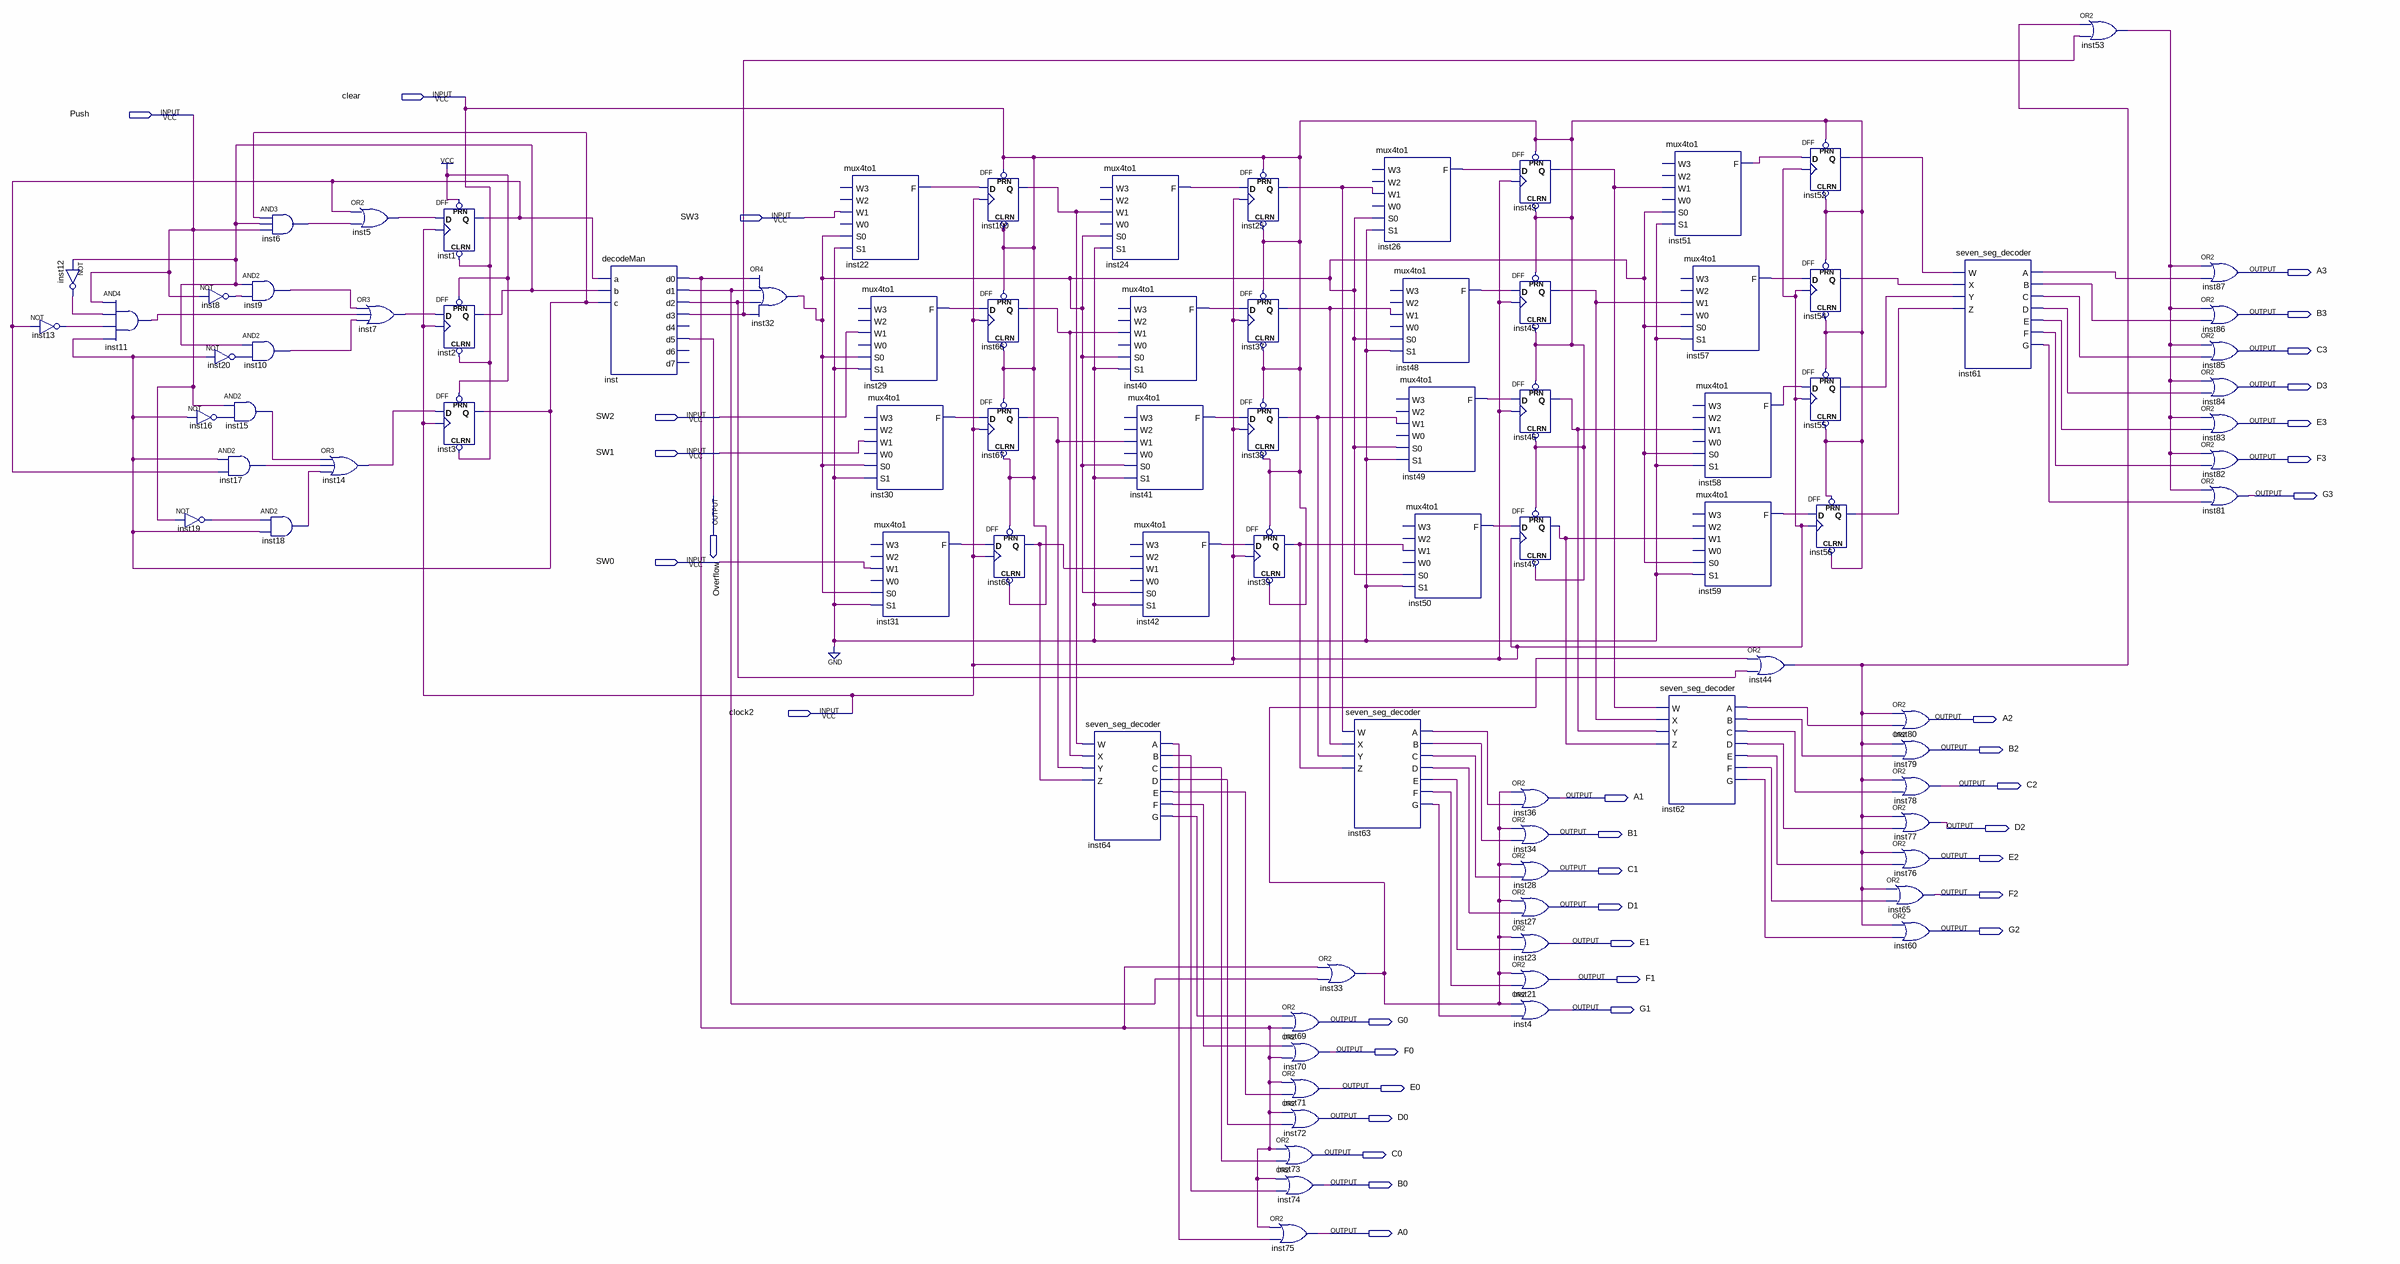
[diagram p0: schematic sheet]
// Quartus schematic Push.bdf as structural Verilog: 88 symbols, 36 pins
module Push (
  input  clear,
  input  Push,
  input  SW3,
  input  SW2,
  input  SW1,
  input  SW0,
  input  clock2,
  output A3,
  output B3,
  output C3,
  output D3,
  output E3,
  output F3,
  output Overflow,
  output G3,
  output A2,
  output B2,
  output C2,
  output A1,
  output D2,
  output B1,
  output E2,
  output C1,
  output F2,
  output D1,
  output G2,
  output E1,
  output F1,
  output G1,
  output G0,
  output F0,
  output E0,
  output D0,
  output C0,
  output B0,
  output A0
);

  wire inst1_q, inst2_q, inst3_q, inst5_out, inst6_out, inst7_out, inst8_out, inst9_out, inst10_out,
       inst11_out, inst12_out, inst13_out, inst14_out, inst15_out, inst16_out, inst17_out, inst18_out,
       inst19_out, inst20_out, inst22_f, inst24_f, inst25_q, inst26_f, inst29_f, inst30_f, inst31_f,
       inst32_out, inst33_out, inst37_q, inst38_q, inst39_q, inst40_f, inst41_f, inst42_f, inst43_q,
       inst44_out, inst45_q, inst46_q, inst47_q, inst48_f, inst49_f, inst50_f, inst51_f, inst52_q,
       inst53_out, inst54_q, inst55_q, inst56_q, inst57_f, inst58_f, inst59_f, inst61_a, inst61_b, inst61_c,
       inst61_d, inst61_e, inst61_f, inst61_g, inst62_a, inst62_b, inst62_c, inst62_d, inst62_e, inst62_f,
       inst62_g, inst63_a, inst63_b, inst63_c, inst63_d, inst63_e, inst63_f, inst63_g, inst64_a, inst64_b,
       inst64_c, inst64_d, inst64_e, inst64_f, inst64_g, inst66_q, inst67_q, inst68_q, inst100_q, inst_d0,
       inst_d1, inst_d2, inst_d3;

  not inst13 (inst13_out, inst1_q);
  not inst12 (inst12_out, inst2_q);
  and inst11 (inst11_out, Push, inst12_out, inst13_out, inst3_q);
  not inst19 (inst19_out, Push);
  not inst8 (inst8_out, Push);
  not inst20 (inst20_out, inst3_q);
  and inst15 (inst15_out, Push, inst16_out);
  not inst16 (inst16_out, inst3_q);
  and inst17 (inst17_out, inst3_q, inst1_q);
  and inst6 (inst6_out, inst3_q, inst2_q, Push);
  and inst9 (inst9_out, inst2_q, inst8_out);
  and inst10 (inst10_out, inst2_q, inst20_out);
  and inst18 (inst18_out, inst19_out, inst3_q);
  or inst14 (inst14_out, inst15_out, inst17_out, inst18_out);
  or inst5 (inst5_out, inst1_q, inst6_out);
  or inst7 (inst7_out, inst9_out, inst11_out, inst10_out);
  DFF inst1 (.CLRN(clear), .CLK(clock2), .D(inst5_out), .PRN(1'b1), .Q(inst1_q));
  DFF inst2 (.CLRN(clear), .CLK(clock2), .D(inst7_out), .PRN(1'b1), .Q(inst2_q));
  DFF inst3 (.CLRN(clear), .CLK(clock2), .D(inst14_out), .PRN(1'b1), .Q(inst3_q));
  decodeMan inst (
    .a(inst1_q), .b(inst2_q), .c(inst3_q), .d0(inst_d0), .d1(inst_d1), .d2(inst_d2), .d3(inst_d3),
    .d5(Overflow));  // open: d4, d6, d7
  or inst32 (inst32_out, inst_d0, inst_d1, inst_d2, inst_d3);
  mux4to1 inst22 (.W1(SW3), .S0(inst32_out), .S1(1'b0), .F(inst22_f));  // open: W3, W2, W0
  mux4to1 inst29 (.W1(SW2), .S0(inst32_out), .S1(1'b0), .F(inst29_f));  // open: W3, W2, W0
  mux4to1 inst30 (.W1(SW1), .S0(inst32_out), .S1(1'b0), .F(inst30_f));  // open: W3, W2, W0
  mux4to1 inst31 (.W1(SW0), .S0(inst32_out), .S1(1'b0), .F(inst31_f));  // open: W3, W2, W0
  DFF inst100 (.CLRN(clear), .CLK(clock2), .D(inst22_f), .PRN(clear), .Q(inst100_q));
  DFF inst66 (.CLRN(clear), .CLK(clock2), .D(inst29_f), .PRN(clear), .Q(inst66_q));
  DFF inst67 (.CLRN(clear), .CLK(clock2), .D(inst30_f), .PRN(clear), .Q(inst67_q));
  DFF inst68 (.CLRN(clear), .CLK(clock2), .D(inst31_f), .PRN(clear), .Q(inst68_q));
  mux4to1 inst24 (.W1(inst100_q), .S0(inst32_out), .S1(1'b0), .F(inst24_f));  // open: W3, W2, W0
  seven_seg_decoder inst64 (
    .W(inst100_q), .X(inst66_q), .Y(inst67_q), .Z(inst68_q), .A(inst64_a), .B(inst64_b), .C(inst64_c),
    .D(inst64_d), .E(inst64_e), .F(inst64_f), .G(inst64_g));
  mux4to1 inst40 (.W1(inst66_q), .S0(inst32_out), .S1(1'b0), .F(inst40_f));  // open: W3, W2, W0
  mux4to1 inst41 (.W1(inst67_q), .S0(inst32_out), .S1(1'b0), .F(inst41_f));  // open: W3, W2, W0
  mux4to1 inst42 (.W1(inst68_q), .S0(inst32_out), .S1(1'b0), .F(inst42_f));  // open: W3, W2, W0
  DFF inst25 (.CLRN(clear), .CLK(clock2), .D(inst24_f), .PRN(clear), .Q(inst25_q));
  DFF inst37 (.CLRN(clear), .CLK(clock2), .D(inst40_f), .PRN(clear), .Q(inst37_q));
  DFF inst38 (.CLRN(clear), .CLK(clock2), .D(inst41_f), .PRN(clear), .Q(inst38_q));
  DFF inst39 (.CLRN(clear), .CLK(clock2), .D(inst42_f), .PRN(clear), .Q(inst39_q));
  or inst69 (G0, inst64_g, inst_d0);
  or inst70 (F0, inst64_f, inst_d0);
  or inst71 (E0, inst_d0, inst64_e);
  or inst72 (D0, inst_d0, inst64_d);
  or inst73 (C0, inst_d0, inst64_c);
  or inst74 (B0, inst_d0, inst64_b);
  or inst75 (A0, inst_d0, inst64_a);
  seven_seg_decoder inst63 (
    .W(inst25_q), .X(inst37_q), .Y(inst38_q), .Z(inst39_q), .A(inst63_a), .B(inst63_b), .C(inst63_c),
    .D(inst63_d), .E(inst63_e), .F(inst63_f), .G(inst63_g));
  or inst33 (inst33_out, inst_d0, inst_d1);
  mux4to1 inst26 (.W1(inst25_q), .S0(inst32_out), .S1(1'b0), .F(inst26_f));  // open: W3, W2, W0
  mux4to1 inst48 (.W1(inst37_q), .S0(inst32_out), .S1(1'b0), .F(inst48_f));  // open: W3, W2, W0
  mux4to1 inst49 (.W1(inst38_q), .S0(inst32_out), .S1(1'b0), .F(inst49_f));  // open: W3, W2, W0
  mux4to1 inst50 (.W1(inst39_q), .S0(inst32_out), .S1(1'b0), .F(inst50_f));  // open: W3, W2, W0
  DFF inst43 (.CLRN(clear), .CLK(clock2), .D(inst26_f), .PRN(clear), .Q(inst43_q));
  DFF inst45 (.CLRN(clear), .CLK(clock2), .D(inst48_f), .PRN(clear), .Q(inst45_q));
  DFF inst46 (.CLRN(clear), .CLK(clock2), .D(inst49_f), .PRN(clear), .Q(inst46_q));
  DFF inst47 (.CLRN(clear), .CLK(clock2), .D(inst50_f), .PRN(clear), .Q(inst47_q));
  or inst36 (A1, inst33_out, inst63_a);
  or inst34 (B1, inst33_out, inst63_b);
  or inst28 (C1, inst33_out, inst63_c);
  or inst27 (D1, inst33_out, inst63_d);
  or inst23 (E1, inst33_out, inst63_e);
  or inst21 (F1, inst33_out, inst63_f);
  or inst4 (G1, inst33_out, inst63_g);
  mux4to1 inst51 (.W1(inst43_q), .S0(inst32_out), .S1(1'b0), .F(inst51_f));  // open: W3, W2, W0
  mux4to1 inst57 (.W1(inst45_q), .S0(inst32_out), .S1(1'b0), .F(inst57_f));  // open: W3, W2, W0
  seven_seg_decoder inst62 (
    .W(inst43_q), .X(inst45_q), .Y(inst46_q), .Z(inst47_q), .A(inst62_a), .B(inst62_b), .C(inst62_c),
    .D(inst62_d), .E(inst62_e), .F(inst62_f), .G(inst62_g));
  mux4to1 inst58 (.W1(inst46_q), .S0(inst32_out), .S1(1'b0), .F(inst58_f));  // open: W3, W2, W0
  mux4to1 inst59 (.W1(inst47_q), .S0(inst32_out), .S1(1'b0), .F(inst59_f));  // open: W3, W2, W0
  or inst44 (inst44_out, inst33_out, inst_d2);
  DFF inst52 (.CLRN(clear), .CLK(clock2), .D(inst51_f), .PRN(clear), .Q(inst52_q));
  DFF inst54 (.CLRN(clear), .CLK(clock2), .D(inst57_f), .PRN(clear), .Q(inst54_q));
  DFF inst55 (.CLRN(clear), .CLK(clock2), .D(inst58_f), .PRN(clear), .Q(inst55_q));
  DFF inst56 (.CLRN(clear), .CLK(clock2), .D(inst59_f), .PRN(clear), .Q(inst56_q));
  // OR2 inst80 has open pins: IN1=inst44_out, IN2=inst62_a, OUT=open
  or inst79 (B2, inst44_out, inst62_b);
  or inst78 (C2, inst44_out, inst62_c);
  or inst77 (D2, inst44_out, inst62_d);
  or inst76 (E2, inst44_out, inst62_e);
  or inst65 (F2, inst44_out, inst62_f);
  or inst60 (G2, inst44_out, inst62_g);
  seven_seg_decoder inst61 (
    .W(inst52_q), .X(inst54_q), .Y(inst55_q), .Z(inst56_q), .A(inst61_a), .B(inst61_b), .C(inst61_c),
    .D(inst61_d), .E(inst61_e), .F(inst61_f), .G(inst61_g));
  or inst53 (inst53_out, inst44_out, inst_d3);
  or inst87 (A3, inst53_out, inst61_a);
  or inst86 (B3, inst53_out, inst61_b);
  or inst85 (C3, inst53_out, inst61_c);
  or inst84 (D3, inst53_out, inst61_d);
  or inst83 (E3, inst53_out, inst61_e);
  or inst82 (F3, inst53_out, inst61_f);
  or inst81 (G3, inst53_out, inst61_g);
endmodule
